# Altium schematic sheet xcvr.SchDoc
size A
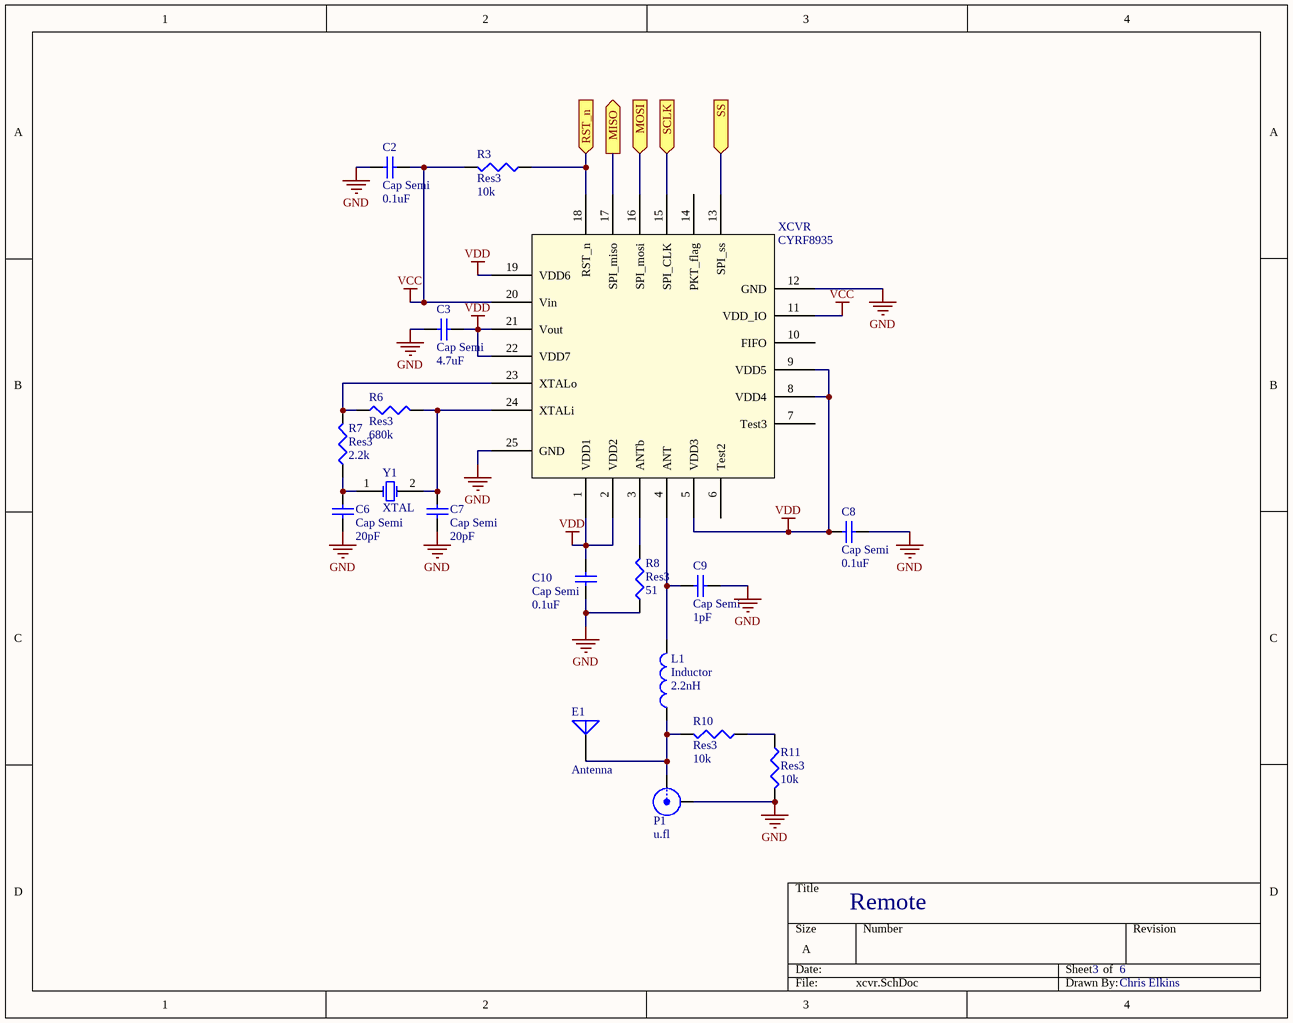
[diagram p0: xcvr.SchDoc]

## Parts
C2  Cap Semi  value 0.1uF  [CAPC1608L]
C3  Cap Semi  value 4.7uF  [CAPC1608L]
C6  Cap Semi  value 20pF  [CAPC1608L]
C7  Cap Semi  value 20pF  [CAPC1608L]
C8  Cap Semi  value 0.1uF  [CAPC1608L]
C9  Cap Semi  value 1pF  [CAPC1608L]
C10  Cap Semi  value 0.1uF  [CAPC1608L]
E1  Antenna  [PIN1]
L1  Inductor  value 2.2nH  [INDC1608L]
P1  u.fl  [U.FL connector]
R3  Res3  value 10k  [RESC1608L]
R6  Res3  value 680k  [RESC1608L]
R7  Res3  value 2.2k  [RESC1608L]
R8  Res3  value 51  [RESC1608L]
R10  Res3  value 10k  [RESC1608L]
R11  Res3  value 10k  [RESC1608L]
XCVR  CYRF8935  [QFN50P400X400-24VAL]
Y1  XTAL  [PCBComponent_1]

## Ports
MISO (out), MOSI (in), RST_n (in), SCLK (in), SS (in)

## Nets
GND: C2.1 C3.1 C6.1 C7.1 C8.1 C9.2 C10.2 P1.2(Y) R8.1 R11.2 XCVR.12(GND) XCVR.25(GND)
VCC: C2.2 R3.2 XCVR.11(VDD_IO) XCVR.20(Vin)
VDD: C3.2 C8.2 C10.1 XCVR.1(VDD1) XCVR.2(VDD2) XCVR.5(VDD3) XCVR.8(VDD4) XCVR.9(VDD5) XCVR.19(VDD6) XCVR.21(Vout) XCVR.22(VDD7)
MISO: XCVR.17(SPI_miso) ; port MISO
MOSI: XCVR.16(SPI_mosi) ; port MOSI
RST_n: R3.1 XCVR.18(RST_n) ; port RST_n
SCLK: XCVR.15(SPI_CLK) ; port SCLK
SS: XCVR.13(SPI_ss) ; port SS
NetC6_2: C6.2 R7.1 Y1.1(OSC1)
NetC7_2: C7.2 R6.2 XCVR.24(XTALi) Y1.2(OSC2)
NetC9_1: C9.1 L1.2 XCVR.4(ANT)
NetE1_1: E1.1(A) L1.1 P1.1(X) R10.2
NetR6_1: R6.1 R7.2 XCVR.23(XTALo)
NetR8_2: R8.2 XCVR.3(ANTb)
NetR10_1: R10.1 R11.1

Not connected (* = marked no-connect by the designer): XCVR 6(Test2) 7(Test3) 10(FIFO) 14(PKT_flag)

## Notes on the sheet
- Remote
- 3
- 6
- Chris Elkins

## Library data of the parts
C2 C3 C6-C10 = Cap Semi: Capacitor (Semiconductor SIM Model); Published: 8-Jun-2000; LatestRevisionDate: 29-May-2009; LatestRevisionNote: IPC-7351 Footprint Added.; PackageReference: C1206; Publisher: Altium Limited; PackageDescription: Chip Capacitor
E1 = Antenna: Generic Antenna; Published: 24-Mar-1999; LatestRevisionDate: 17-Jul-2002; LatestRevisionNote: Re-released for DXP Platform.; PackageReference: PIN1; Publisher: Altium Limited
L1 = Inductor: Code_IEC: 1005; Published: 8-Jun-2000; LatestRevisionDate: 29-May-2009; LatestRevisionNote: IPC-7351 Footprint Added.; PackageReference: 0402-A; Publisher: Altium Limited; PackageDescription: Chip Inductor; Code_JEITA: 0402
P1 = BNC: BNC Elbow Connector; LatestRevisionDate: 17-Jul-2002; LatestRevisionNote: Re-released for DXP Platform.; Publisher: Altium Limited
R3 R6-R8 R10 R11 = Res3: Resistor; Published: 8-Jun-2000; LatestRevisionDate: 29-May-2009; LatestRevisionNote: IPC-7351 Footprint Added.; PackageReference: J1-0603; Publisher: Altium Limited; PackageDescription: Chip Resistor
Y1 = XTAL: Crystal Oscillator; Published: 8-Jun-2000; LatestRevisionDate: 17-Jul-2002; LatestRevisionNote: Re-released for DXP Platform.; PackageReference: R38; Publisher: Altium Limited